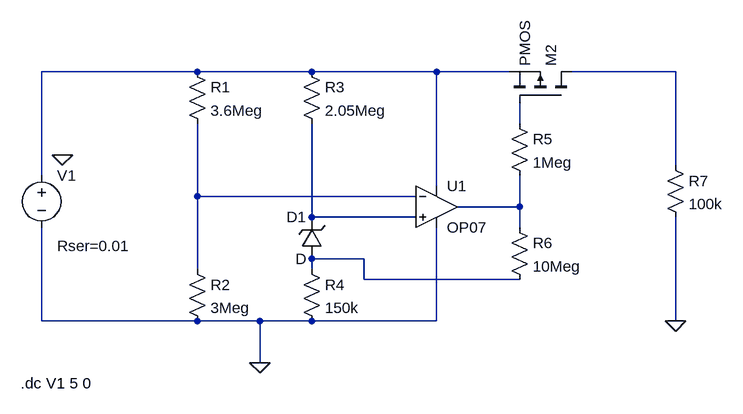
[diagram p0: schematic UVLO.asc]
UVLO.asc, the LTspice schematic file:
Version 4
SHEET 1 1400 680
WIRE 208 -128 -32 -128
WIRE 384 -128 208 -128
WIRE 576 -128 384 -128
WIRE 688 -128 576 -128
WIRE 944 -128 784 -128
WIRE 704 -48 704 -80
WIRE 944 16 944 -128
WIRE -32 32 -32 -128
WIRE 576 48 576 -128
WIRE 208 64 208 -48
WIRE 544 64 208 64
WIRE 704 80 704 32
WIRE 704 80 608 80
WIRE 384 96 384 -48
WIRE 544 96 384 96
WIRE 704 112 704 80
WIRE 464 160 384 160
WIRE 208 176 208 64
WIRE 384 176 384 160
WIRE 464 192 464 160
WIRE 704 192 464 192
WIRE -32 256 -32 112
WIRE 208 256 -32 256
WIRE 304 256 208 256
WIRE 384 256 304 256
WIRE 576 256 576 112
WIRE 576 256 384 256
WIRE 944 256 944 96
WIRE 304 320 304 256
FLAG 304 320 0
FLAG 944 256 0
FLAG 0 0 0
SYMBOL voltage -32 16 R0
WINDOW 123 0 0 Left 0
WINDOW 39 24 124 Left 2
WINDOW 3 24 152 Left 2
SYMATTR SpiceLine Rser=0.01
SYMATTR InstName V1
SYMATTR Value ""
SYMBOL res 192 -144 R0
SYMATTR InstName R1
SYMATTR Value 3.6Meg
SYMBOL res 192 160 R0
SYMATTR InstName R2
SYMATTR Value 3Meg
SYMBOL res 368 -144 R0
SYMATTR InstName R3
SYMATTR Value 2.05Meg
SYMBOL res 368 160 R0
SYMATTR InstName R4
SYMATTR Value 150k
SYMBOL OpAmps\\OP07 576 16 R0
SYMATTR InstName U1
SYMBOL res 688 -64 R0
SYMATTR InstName R5
SYMATTR Value 1Meg
SYMBOL res 688 96 R0
SYMATTR InstName R6
SYMATTR Value 10Meg
SYMBOL res 928 0 R0
SYMATTR InstName R7
SYMATTR Value 100k
SYMBOL zener 400 160 R180
WINDOW 0 24 64 Left 2
WINDOW 3 24 0 Left 2
SYMATTR InstName D1
SYMBOL pmos 784 -80 M270
SYMATTR InstName M2
TEXT -64 352 Left 2 !.dc V1 5 0

The netlist it stands for:
* UVLO.asc
V1 N001 0 Rser=0.01
R1 N001 N004 3.6Meg
R2 N004 0 3Meg
R3 N001 N006 2.05Meg
R4 N007 0 150k
XU1 N006 N004 N001 0 N005 LT1001  ; OP07, pins In+ In- V+ V- OUT
R5 N003 N005 1Meg
R6 N005 N007 10Meg
R7 N002 0 100k
D1 N007 N006 D
M2 N002 N003 N001 N001 PMOS
.model D D
.lib standard.dio
.model NMOS NMOS
.model PMOS PMOS
.lib standard.mos
.dc V1 5 0
.lib LTC.lib
.backanno
.end